# Altium schematic sheet Main.SchDoc
size A2; SheetNumber: 1; SheetTotal: 7
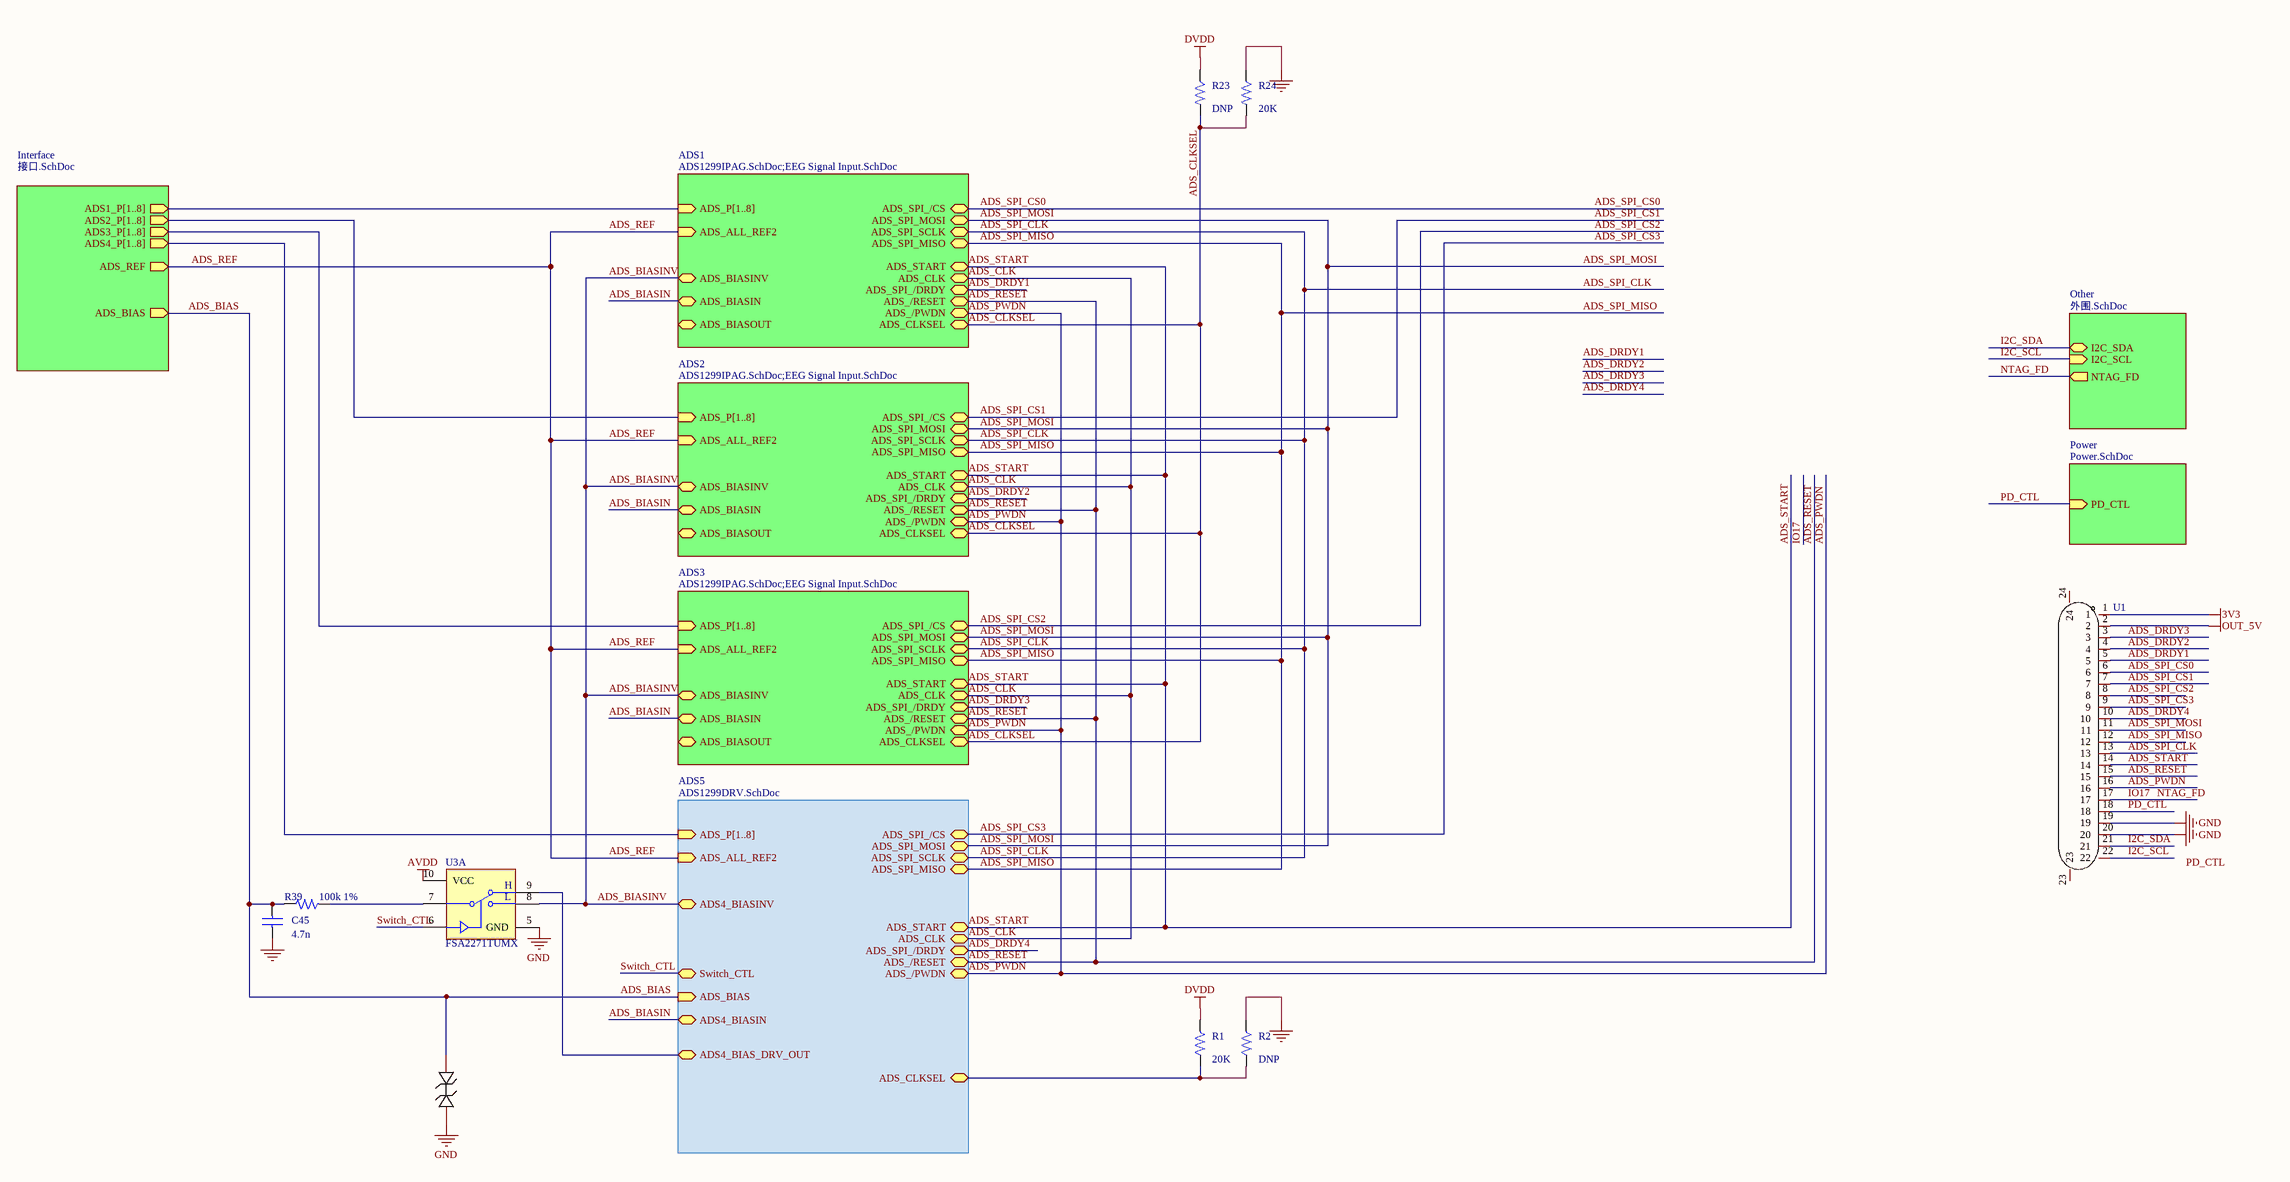
[diagram p0: Main.SchDoc]

## Parts
C45  4.7n  [0201_C]
D13  D5V0X1B2LP3-7  [X3-DFN0603-2_L0.6-W0.3-BI]  (value not drawn)
R1  20K  [0201_R]
R2  DNP  [0201_R]
R23  DNP  [0201_R]
R24  20K  [0201_R]
R39  100k 1%  [0201_R]
U1  KH-FPC0.5-H1.0SMT-22P-QCHF  [FPC-SMD_22P-P0.50_XKB_X05A10L22G]  (value not drawn)
U3  FSA2271TUMX  [UFQFN-10(1.4x1.8)]  (part A of 2)

## Sub-sheets
ADS1 = ADS1299IPAG.SchDoc;EEG Signal Input.SchDoc: ADS_P[1..8] (in), ADS_SPI_MOSI (bidir), ADS_SPI_/CS (bidir), ADS_SPI_SCLK (bidir), ADS_SPI_MISO (bidir), ADS_ALL_REF2 (in), ADS_BIASINV (bidir), ADS_START (bidir), ADS_CLK (bidir), ADS_SPI_/DRDY (bidir), ADS_/RESET (bidir), ADS_/PWDN (bidir), ADS_BIASIN (bidir), ADS_CLKSEL (bidir), ADS_BIASOUT (bidir)
ADS2 = ADS1299IPAG.SchDoc;EEG Signal Input.SchDoc: ADS_P[1..8] (in), ADS_SPI_MOSI (bidir), ADS_SPI_/CS (bidir), ADS_SPI_SCLK (bidir), ADS_SPI_MISO (bidir), ADS_ALL_REF2 (in), ADS_BIASINV (bidir), ADS_START (bidir), ADS_CLK (bidir), ADS_SPI_/DRDY (bidir), ADS_/RESET (bidir), ADS_/PWDN (bidir), ADS_BIASIN (bidir), ADS_CLKSEL (bidir), ADS_BIASOUT (bidir)
ADS3 = ADS1299IPAG.SchDoc;EEG Signal Input.SchDoc: ADS_P[1..8] (in), ADS_SPI_MOSI (bidir), ADS_SPI_/CS (bidir), ADS_SPI_SCLK (bidir), ADS_SPI_MISO (bidir), ADS_ALL_REF2 (in), ADS_BIASINV (bidir), ADS_START (bidir), ADS_CLK (bidir), ADS_SPI_/DRDY (bidir), ADS_/RESET (bidir), ADS_/PWDN (bidir), ADS_BIASIN (bidir), ADS_CLKSEL (bidir), ADS_BIASOUT (bidir)
ADS5 = ADS1299DRV.SchDoc: ADS_SPI_MOSI (bidir), ADS_SPI_/CS (bidir), ADS_SPI_SCLK (bidir), ADS_SPI_MISO (bidir), ADS_ALL_REF2 (in), ADS4_BIAS_DRV_OUT (bidir), ADS_START (bidir), ADS_CLK (bidir), ADS_SPI_/DRDY (bidir), ADS_/RESET (bidir), ADS_/PWDN (bidir), Switch_CTL (bidir), ADS4_BIASINV (bidir), ADS_BIAS (in), ADS4_BIASIN (bidir), ADS_P[1..8] (in), ADS_CLKSEL (bidir)
Interface = 接口.SchDoc: ADS1_P[1..8] (out), ADS2_P[1..8] (out), ADS3_P[1..8] (out), ADS4_P[1..8] (out), ADS_BIAS (out), ADS_REF (out)
Other = 外围.SchDoc: I2C_SCL (in), I2C_SDA (bidir), NTAG_FD (out)
Power = Power.SchDoc: PD_CTL (in)

## Nets
3V3: U1.1
AVDD: U3.10(VCC)
DVDD: R1.1 R23.1
GND: C45.1 D13.1 R2.1 R24.1 U1.19 U1.20 U3.5(GND)
OUT_5V: U1.2
ADS_BIAS: C45.2 D13.2 R39.2 ; sheet Interface/ADS_BIAS, sheet ADS5/ADS_BIAS
ADS_BIASIN: sheet ADS1/ADS_BIASIN, sheet ADS2/ADS_BIASIN, sheet ADS3/ADS_BIASIN, sheet ADS5/ADS4_BIASIN
ADS_BIASINV: U3.8(1B0) ; sheet ADS1/ADS_BIASINV, sheet ADS2/ADS_BIASINV, sheet ADS3/ADS_BIASINV, sheet ADS5/ADS4_BIASINV
ADS_CLK: sheet ADS1/ADS_CLK, sheet ADS2/ADS_CLK, sheet ADS3/ADS_CLK, sheet ADS5/ADS_CLK
ADS_CLKSEL: R23.2 R24.2 ; sheet ADS1/ADS_CLKSEL, sheet ADS2/ADS_CLKSEL, sheet ADS3/ADS_CLKSEL
ADS_DRDY1: U1.5 ; sheet ADS1/ADS_SPI_/DRDY
ADS_DRDY2: U1.4 ; sheet ADS2/ADS_SPI_/DRDY
ADS_DRDY3: U1.3 ; sheet ADS3/ADS_SPI_/DRDY
ADS_DRDY4: U1.10 ; sheet ADS5/ADS_SPI_/DRDY
ADS_PWDN: U1.16 ; sheet ADS1/ADS_/PWDN, sheet ADS2/ADS_/PWDN, sheet ADS3/ADS_/PWDN, sheet ADS5/ADS_/PWDN
ADS_REF: sheet ADS1/ADS_ALL_REF2, sheet Interface/ADS_REF, sheet ADS2/ADS_ALL_REF2, sheet ADS3/ADS_ALL_REF2, sheet ADS5/ADS_ALL_REF2
ADS_RESET: U1.15 ; sheet ADS1/ADS_/RESET, sheet ADS2/ADS_/RESET, sheet ADS3/ADS_/RESET, sheet ADS5/ADS_/RESET
ADS_SPI_CLK: U1.13 ; sheet ADS1/ADS_SPI_SCLK, sheet ADS2/ADS_SPI_SCLK, sheet ADS3/ADS_SPI_SCLK, sheet ADS5/ADS_SPI_SCLK
ADS_SPI_CS0: U1.6 ; sheet ADS1/ADS_SPI_/CS
ADS_SPI_CS1: U1.7 ; sheet ADS2/ADS_SPI_/CS
ADS_SPI_CS2: U1.8 ; sheet ADS3/ADS_SPI_/CS
ADS_SPI_CS3: U1.9 ; sheet ADS5/ADS_SPI_/CS
ADS_SPI_MISO: U1.12 ; sheet ADS1/ADS_SPI_MISO, sheet ADS2/ADS_SPI_MISO, sheet ADS3/ADS_SPI_MISO, sheet ADS5/ADS_SPI_MISO
ADS_SPI_MOSI: U1.11 ; sheet ADS1/ADS_SPI_MOSI, sheet ADS2/ADS_SPI_MOSI, sheet ADS3/ADS_SPI_MOSI, sheet ADS5/ADS_SPI_MOSI
ADS_START: U1.14 ; sheet ADS1/ADS_START, sheet ADS2/ADS_START, sheet ADS3/ADS_START, sheet ADS5/ADS_START
I2C_SCL: U1.22 ; sheet Other/I2C_SCL
I2C_SDA: U1.21 ; sheet Other/I2C_SDA
IO17: U1.17 ; sheet Other/NTAG_FD  [also labelled NTAG_FD]
PD_CTL: U1.18 ; sheet Power/PD_CTL
Switch_CTL: U3.6(S1) ; sheet ADS5/Switch_CTL
NetR1_2: R1.2 R2.2 ; sheet ADS5/ADS_CLKSEL
NetR39_1: R39.1 U3.7(1A)
NetU3_9: U3.9(1B1) ; sheet ADS5/ADS4_BIAS_DRV_OUT

Not connected (* = marked no-connect by the designer): U1 23 24

## Buses and harness runs
bus sheet ADS1/ADS_P[1..8] = sheet Interface/ADS1_P[1..8]
bus sheet ADS2/ADS_P[1..8] = sheet Interface/ADS2_P[1..8]
bus sheet ADS3/ADS_P[1..8] = sheet Interface/ADS3_P[1..8]
bus sheet ADS5/ADS_P[1..8] = sheet Interface/ADS4_P[1..8]

## Notes on the sheet
- Labels drawn without touching a wire or pin: PD_CTL
- (in symbol FSA2271TUMX, part A) H; L

## Library data of the parts
C45 = CAP0402: CAP CER 4700PF 50V X7R 0402; Part Number: CC0402KRX7R9BB472; Manufacturer: YAGEO; FPLIST: 0402_smd; PCB Footprint: C0603; Distributor: LCSC; Distributor Part Number: C106208; Distributor Link: https://item.szlcsc.com/107423.html; Manufacturer Part Number: CC0402KRX7R9BB472
D13 = D5V0X1B2LP3-7: Manufacturer: DIODES(美台); Add into BOM: yes; Reverse Stand-Off Voltage (Vrwm): 5.5V; Breakdown Voltage (VBR): 7V; Clamping Voltage@Ipp: 14V; Junction Capacitance(Cj)@1MHz: 0.3pF@1MHz; Name: D5V0X1B2LP3-7; Symbol: D5V0X1B2LP3-7; Device: D5V0X1B2LP3-7; LCSC Part Name: D5V0X1B2LP3-7; Supplier Part: C526514; Manufacturer Part: D5V0X1B2LP3-7; Supplier Footprint: X3-DFN0603-2; JLCPCB Part Class: Extended Part; Datasheet: https://atta.szlcsc.com/upload/public/pdf/source/20200528/C526514_1B9BA5DE30498B0D24898FE9BE74AB8A.pdf; Supplier: LCSC; Convert to PCB: yes; Peak Pulse Power(Ppp)@8/20us: -; Operating Temperature: -65℃~+150℃@(Tj)
R1 R24 = RES: RES SMD 0 OHM JUMPER 1/16W 0402; Part Number: RC0402FR-070RL; Manufacturer: YAGEO; PCB Footprint: R0402; Distributor Link: https://item.szlcsc.com/107446.html; Distributor: LCSC; Distributor Part Number: C106231; Manufacturer Part Number: RC0402FR-070RL
R2 R23 = RES: PCB Footprint: R0402
R39 = RES: Part Number: RC0402FR-074K99L; Manufacturer: YAGEO; PCB Footprint: R0402; Distributor Link: https://item.szlcsc.com/149281.html; Distributor: LCSC; Distributor Part Number: C137965; Manufacturer Part Number: RC0402FR-074K99L
U1 = KH-FPC0.5-H1.0SMT-22P-QCHF: 锁定特性:翻盖式;触点数量:22P;间距:0.5mm;; Manufacturer: kinghelm(金航标); Add into BOM: yes; Locking Feature: 翻盖式; Number of Contacts: 22P; Pitch: 0.5mm; Name: KH-FPC0.5-H1.0SMT-22P-QCHF; Symbol: KH-FPC0.5-H1.0SMT-22P-QCHF; Device: KH-FPC0.5-H1.0SMT-22P-QCHF; LCSC Part Name: KH-FPC0.5-H1.0SMT-22P-QCHF; Supplier Part: C3250120; Manufacturer Part: KH-FPC0.5-H1.0SMT-22P-QCHF; Supplier Footprint: SMD,P=0.5mm; JLCPCB Part Class: 扩展库; Datasheet: https://atta.szlcsc.com/upload/public/pdf/source/20220629/AF128159C3D91429B5983CCCE2A07C6D.pdf; Supplier: LCSC; Convert to PCB: yes; Height Above Board: 1mm